# Altium schematic sheet 07_ZYNQ_PL.SchDoc
size A3; SheetNumber: 7; SheetTotal: 9
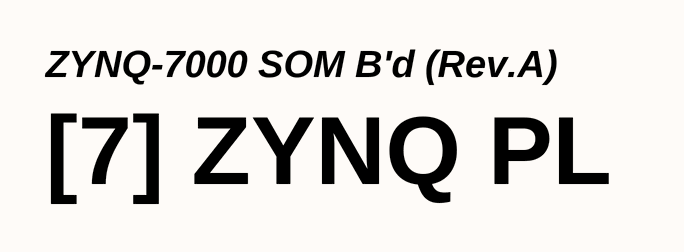
[diagram p0: 07_ZYNQ_PL.SchDoc]

## Notes on the sheet
- ZYNQ-7000 SOM B'd (Rev.A)
- [7] ZYNQ PL
- Title
- Rev
- Doc
- Sheet #
- of
- Author
- This document is copyright of ArkX and shall not be revealed, produced, copied, in whole or in part,
- Date
- nor used for any purpose other than submitted.